# Altium schematic sheet Switch_Led.SchDoc: Arduino-SLVN
size A4; Date: no entry; ApprovedBy: no entry; CheckedBy: no entry; Author: mattmue; CompanyName: ETH Zürich; DrawnBy: no entry; Engineer: no entry; Organization: ETH Zürich; Address1: Robotic Systems Lab; Address2: Leonhardstrasse 21; Address3: 8092 Zürich; Address4: Swizerland; DocumentNumber: no entry; Revision: 01; SheetNumber: 2; SheetTotal: 2; Time: no entry; ImagePath: no entry; Application_BuildNumber: no entry
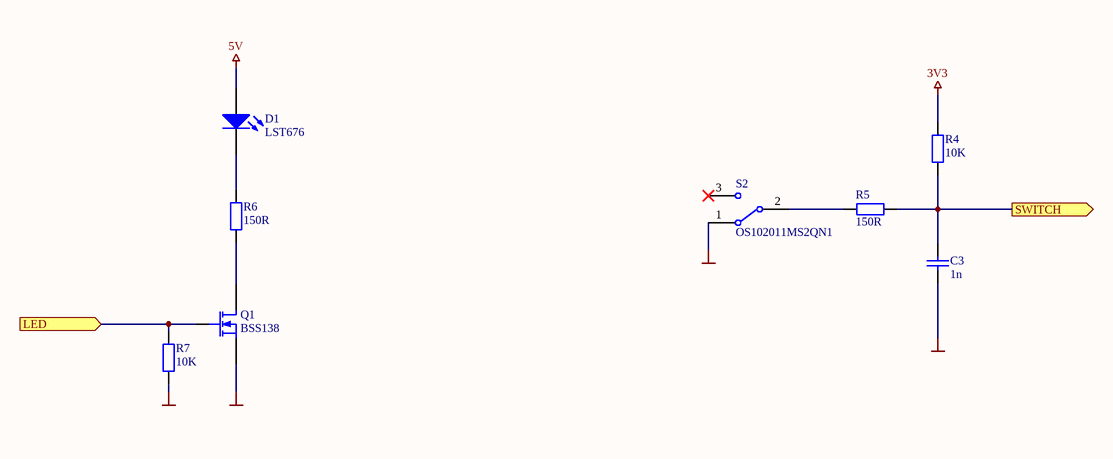
[diagram p0: Switch_Led.SchDoc]

## Parts
C3  value 1n  [SMD_CAPC1608X08N]  (hidden comment: C0603)
D1  LST676  [2-PLCC]
Q1  BSS138  [SOT323 SC70]
R4  value 10K  [SMD_RESC1608X05N]  (hidden comment: R0603)
R5  value 150R  [SMD_RESC1608X05N]  (hidden comment: R0603)
R6  value 150R  [SMD_RESC1608X05N]  (hidden comment: R0603)
R7  value 10K  [SMD_RESC1608X05N]  (hidden comment: R0603)
S2  OS102011MS2QN1  [THT_SLIDESWITCH_86X43]

## Ports
LED (in), SWITCH (out)

## Nets
3V3: R4.2
5V: D1.1(A)
GND: C3.1 Q1.2(S) R7.1 S2.1
LED: Q1.1(G) R7.2 ; port LED
SWITCH: C3.2 R4.1 R5.1 ; port SWITCH
NetD1_2: D1.2(K) R6.2
NetQ1_3: Q1.3(D) R6.1
NetR5_2: R5.2 S2.2

Not connected (* = marked no-connect by the designer): S2 3*

## Notes on the sheet
- Title
- Size:
- Date:
- A4
- Number:
- Time:
- of
- Revision:
- Sheet:
- Author:
- Filename:

## Library data of the parts
C3 = CMP-02314-1: CERCAP 1n 100V 1% NP0/C0G 0603; Manufacturer: KEMET; Manufacturer Part Number: C0603C102F1GAC7867; Supplier: Digi-Key; Supplier Part Number: 399-17967-1-ND
D1 = CMP-01594-1: LED RED 30mA 2V 3x3.4mm; Manufacturer: OSRAM Opto Semiconductors Inc.; Manufacturer Part Number: LS T676-R1S1-1-Z; Supplier: Digi-Key; Supplier Part Number: 475-2683-1-ND
Q1 = CMP-01592-1: MOSFET N 0.2A 50V SOT323; Manufacturer2 Part Number: BSS138W-TP; Manufacturer: Diodes Incorporated; Manufacturer Part Number: BSS138W-7-F; Manufacturer2: Micro Commercial Co; Supplier2 Part Number: BSS138W-TPMSCT-ND; Supplier2: Digi-Key; Supplier Part Number: BSS138W-FDICT-ND; Supplier: Digi-Key
R4 R7 = CMPL-001-0158-A.2: RES 10K 100mW 1% 0603; Manufacturer: YAEGO; Manufacturer Part Number: RC0603FR-0710KL; Manufacturer2 Part Number: CRCW060310K0FKEA; Manufacturer2: Vishay Dale; Supplier: Digi-Key; Supplier Part Number: 311-10.0KHRCT-ND; Supplier2: Digi-Key; Supplier2 Part Number: 541-10.0KHCT-ND
R5 R6 = CMPL-001-0114-A.2: RES 150R 100mW 1% 0603; Manufacturer: YAEGO; Manufacturer Part Number: RC0603FR-07150RL; Manufacturer2 Part Number: CRCW0603150RFKEA; Manufacturer2: Vishay Dale; Supplier: Digi-Key; Supplier Part Number: 311-150HRCT-ND; Supplier2: Digi-Key; Supplier2 Part Number: 541-150HCT-ND
S2 = CMPL-001-0005-2: SWITCH SPDT 12V 0.1A 4.3x8.6mm; Manufacturer: C&K; Manufacturer Part Number: OS102011MS2QN1; Supplier: Digi-Key; Supplier Part Number: CKN9565-ND